# Altium schematic sheet Power_Section.schDoc
size A; SheetNumber: 1; SheetTotal: 8
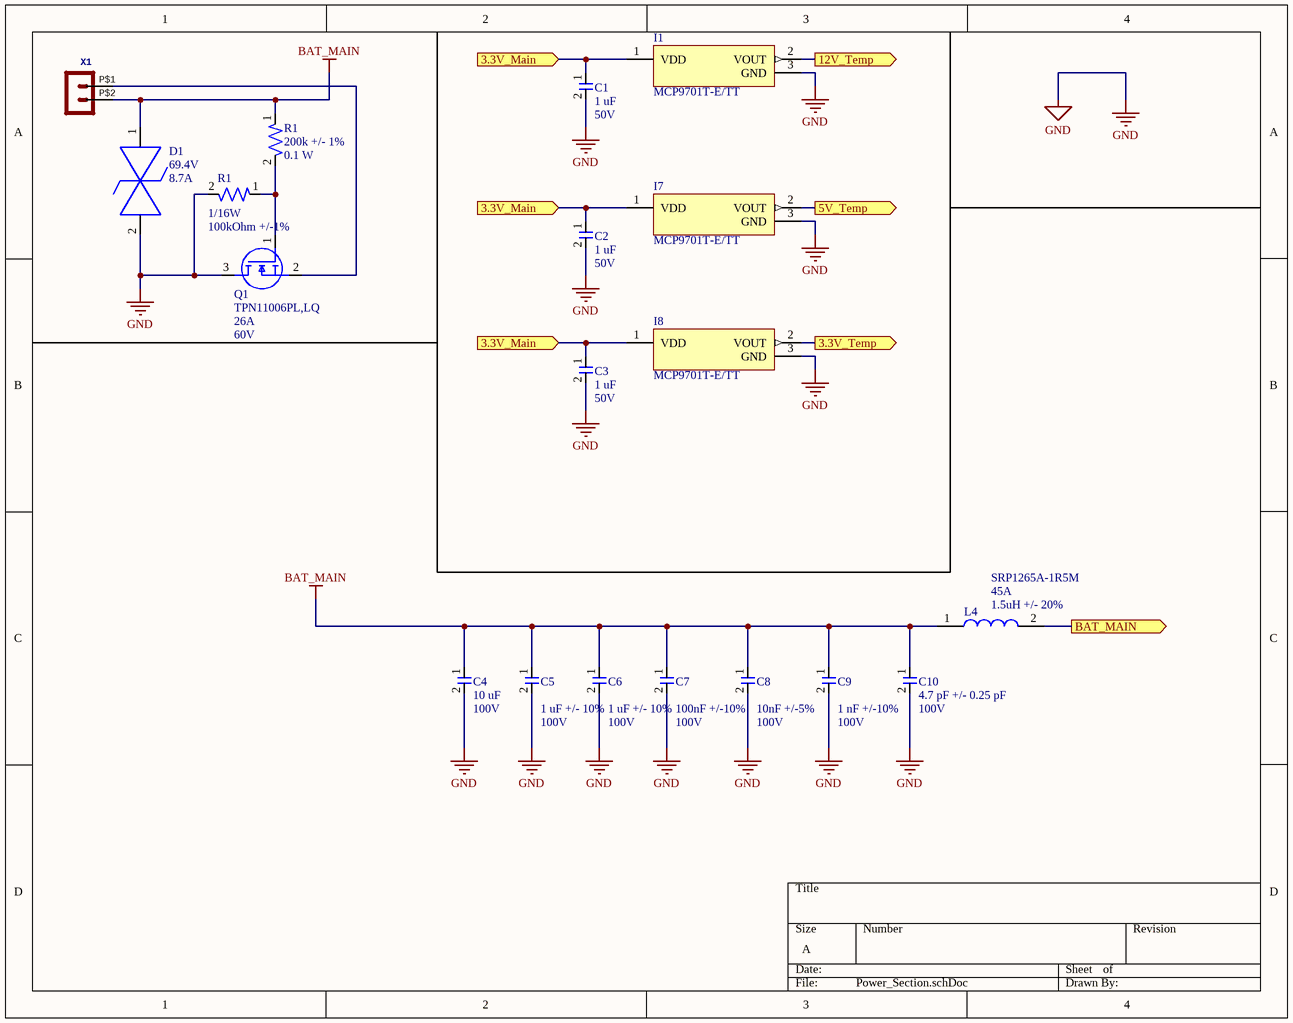
[diagram p0: Power_Section.schDoc]

## Parts
(Parts that share a designator on the sheet are numbered #1, #2 ... from top to bottom, then left to right.)
C1  Capacitance: 1 uF  Voltage: 50V  [CAP-0603]  (hidden comment: UMK107AB7105KA-T)
C2  Capacitance: 1 uF  Voltage: 50V  [CAP-0603]  (hidden comment: UMK107AB7105KA-T)
C3  Capacitance: 1 uF  Voltage: 50V  [CAP-0603]  (hidden comment: UMK107AB7105KA-T)
C4  Capcitance: 10 uF  Voltage Rating: 100V  [CAP-1210]  (hidden comment: GRM32EC72A106KE05L)
C5  Capacitance: 1 uF +/- 10%  Voltage: 100V  [CAP-1206 - duplicate]  (hidden comment: CAP-1U-0001)
C6  Capacitance: 1 uF +/- 10%  Voltage: 100V  [CAP-1206 - duplicate]  (hidden comment: CAP-1U-0001)
C7  Capacitance: 100nF +/-10%  Voltage Rating: 100V  [CAP-0603]  (hidden comment: CC0603KRX7R0BB104)
C8  Capacitance: 10nF +/-5%  Voltage Rating: 100V  [CAP-0603]  (hidden comment: C1608C0G2A103J080AC)
C9  Capacitance: 1 nF +/-10%  Voltage: 100V  [CAP-0603]  (hidden comment: CAP-1N-0001)
C10  Capacitance: 4.7 pF +/- 0.25 pF  Voltage: 100V  [CAP-0603]  (hidden comment: CC0603CRNPO0BN4R7)
D1  Vclamp: 69.4V  Peak pulser current: 8.7A  [DO-214AA (SMBJ)]  (hidden comment: SMBJE43CAH)
I1  MCP9701T-E/TT  [IC-TEMP-0001]
I7  MCP9701T-E/TT  [IC-TEMP-0001]
I8  MCP9701T-E/TT  [IC-TEMP-0001]
L4  SRP1265A-1R5M  Saturation Current: 45A  Inductance: 1.5uH +/- 20%  [PWRIND-1.5U-0002]
Q1  TPN11006PL,LQ  Id-Continuous: 26A  VDS-Max: 60V  [NMOS-8TSON]
R1#1  Resistance: 200k +/- 1%  Power Rating: 0.1 W  [RES-0603]  (hidden comment: ERJ-3EKF2003V)
R1#2  Power Rating: 1/16W  Resistance: 100kOhm +/-1%  [RES-0402]  (hidden comment: AF0402FR-07100KL)
X1  Molex - Micro-Fit 3.0 Series connector,  3.00mm (0.118") pitch header, 2 positions.  [43045-0200]  (value not drawn)

## Ports
3.3V_Main (in), 3.3V_Temp (out), 5V_Temp (out), 12V_Temp (out), BAT_MAIN (out)

## Nets
BAT_MAIN: C4.1 C5.1 C6.1 C7.1 C8.1 C9.1 C10.1 D1.1 L4.1 R1#1.1 X1.P$2
GND: C1.2 C2.2 C3.2 C4.2 C5.2 C6.2 C7.2 C8.2 C9.2 C10.2 D1.2 I1.3(GND) I7.3(GND) I8.3(GND) Q1.3(D) R1#2.2
3.3V_Main: C1.1 C2.1 C3.1 I1.1(VDD) I7.1(VDD) I8.1(VDD) ; port 3.3V_Main
3.3V_Temp: I8.2(VOUT) ; port 3.3V_Temp
5V_Temp: I7.2(VOUT) ; port 5V_Temp
12V_Temp: I1.2(VOUT) ; port 12V_Temp
BAT_MAIN: L4.2 ; port BAT_MAIN  [a separate net that carries the same name]
NetQ1_1: Q1.1(G) R1#1.2 R1#2.1
NetQ1_2: Q1.2(S) X1.P$1

## Library data of the parts
C1-C3 = CAP-1U-0002: 1 µF ±10% 50V Ceramic Capacitor X7R 0603 (1608 Metric); Package Size: 0603
C4 = CAP-10U-0003: 10 µF ±10% 100V Ceramic Capacitor X7S 1210 (3225 Metric); Package Size: 1210
C5 C6 = CAP-1U-0001: 1 µF ±10% 100V Ceramic Capacitor X7R 1206 (3216 Metric)
C7 = CAP-100N-0001: CAP CER 0.1UF 100V X7R 0603; Manufacturer: YAGEO; Assembled?: no; Manufacturer Part Number: CC0603KRX7R0BB104; Temperature Coefficient: X7R; Package Size: 0603
C8 = CAP-10N-0002: CAP CER 10000PF 100V C0G 0603; Manufacturer: TDK Corporation; Temperature Coefficient: C0G/NP0; Assembled?: no; Manufacturer Part Number: C1608C0G2A103J080AC; Package Size: 0603
C9 = CAP-1N-0001: 1000 pF ±10% 100V Ceramic Capacitor X7R 0603 (1608 Metric)
C10 = CAP-4.7P-0002: 4.7 pF ±0.25pF 100V Ceramic Capacitor C0G, NP0 0603 (1608 Metric)
D1 = DIO-69.4V-0001: 69.4V Clamp 8.7A Ipp Tvs Diode Surface Mount DO-214AA (SMBJ); Channels: Bidirectional; Breakdown VOltage: 47.8V; Reverse working maximum voltage: 43V; Package: DO-214AA (SMBJ)
I1 I7 I8 = IC-TEMP-0001: Temperature Sensor Analog, Local -10°C ~ 125°C 19.5mV/°C SOT-23-3; Manufacturer: Microchip Technology; Assembled?: no; VCC-Max: 5.5V; VCC-Min: 3.3V; Manufacturer Part Number: MCP9701T-E/TT; Package: SOT-23-3
L4 = PWRIND-1.5U-0002: 1.5 µH Shielded Drum Core, Wirewound Inductor 27 A 3mOhm Max Nonstandard; Manufacturer: Bourns Electronics; Type: DEV; DC Resistnace: 3.0mOhm max; Copyright: Copyright (C) 2022 Ultra Librarian. All rights reserved.; Manufacturer Part Number: SRP1265A-1R5M; Dimensions: 12.5x13.5x6.2
Q1 = NMOS-26A-0001: N-Channel 60 V 26A (Tc) 610mW (Ta), 61W (Tc) Surface Mount 8-TSON Advance (3.1x3.1); Manufacturer: Toshiba; Rds On-Max: 18.1mOhm; Vgs-Max: 20V; Assembled?: no; Manufacturer Part Number: TPN11006PL,LQ; FET type: N-Channel; Package: 8-TSON Advance
R1#1 = RES-200K-0001: 200 kOhms ±1% 0.1W, 1/10W Chip Resistor 0603 (1608 Metric) Automotive AEC-Q200 Thick Film; Manufacturer: Panasonic Electronic Components; Assembled?: Yes; MFP: ERJ-3EKF2003V; Package SIze: 0603
R1#2 = RES-100K-0001: 100 kOhms ±1% 0.063W, 1/16W Chip Resistor 0402 (1005 Metric) Anti-Sulfur, Automotive AEC-Q200 Thick Film; Manufacturer: YAGEO; Assembled?: no; Manufacturer Part Number: AF0402FR-07100KL; Package Size: 0402
X1 = HEADER_POS2_?43045-0200: GateName_1: G$1; SymbolName_1: HEADER_POS2; DeviceName: 43045-0200; LibraryName: con-molex-micro-fit-3_0_2; DeviceSetName: HEADER_POS2_?; Package: 43045-0200